# Altium schematic sheet BUJT13-VN02-20140328.SchDoc
size C
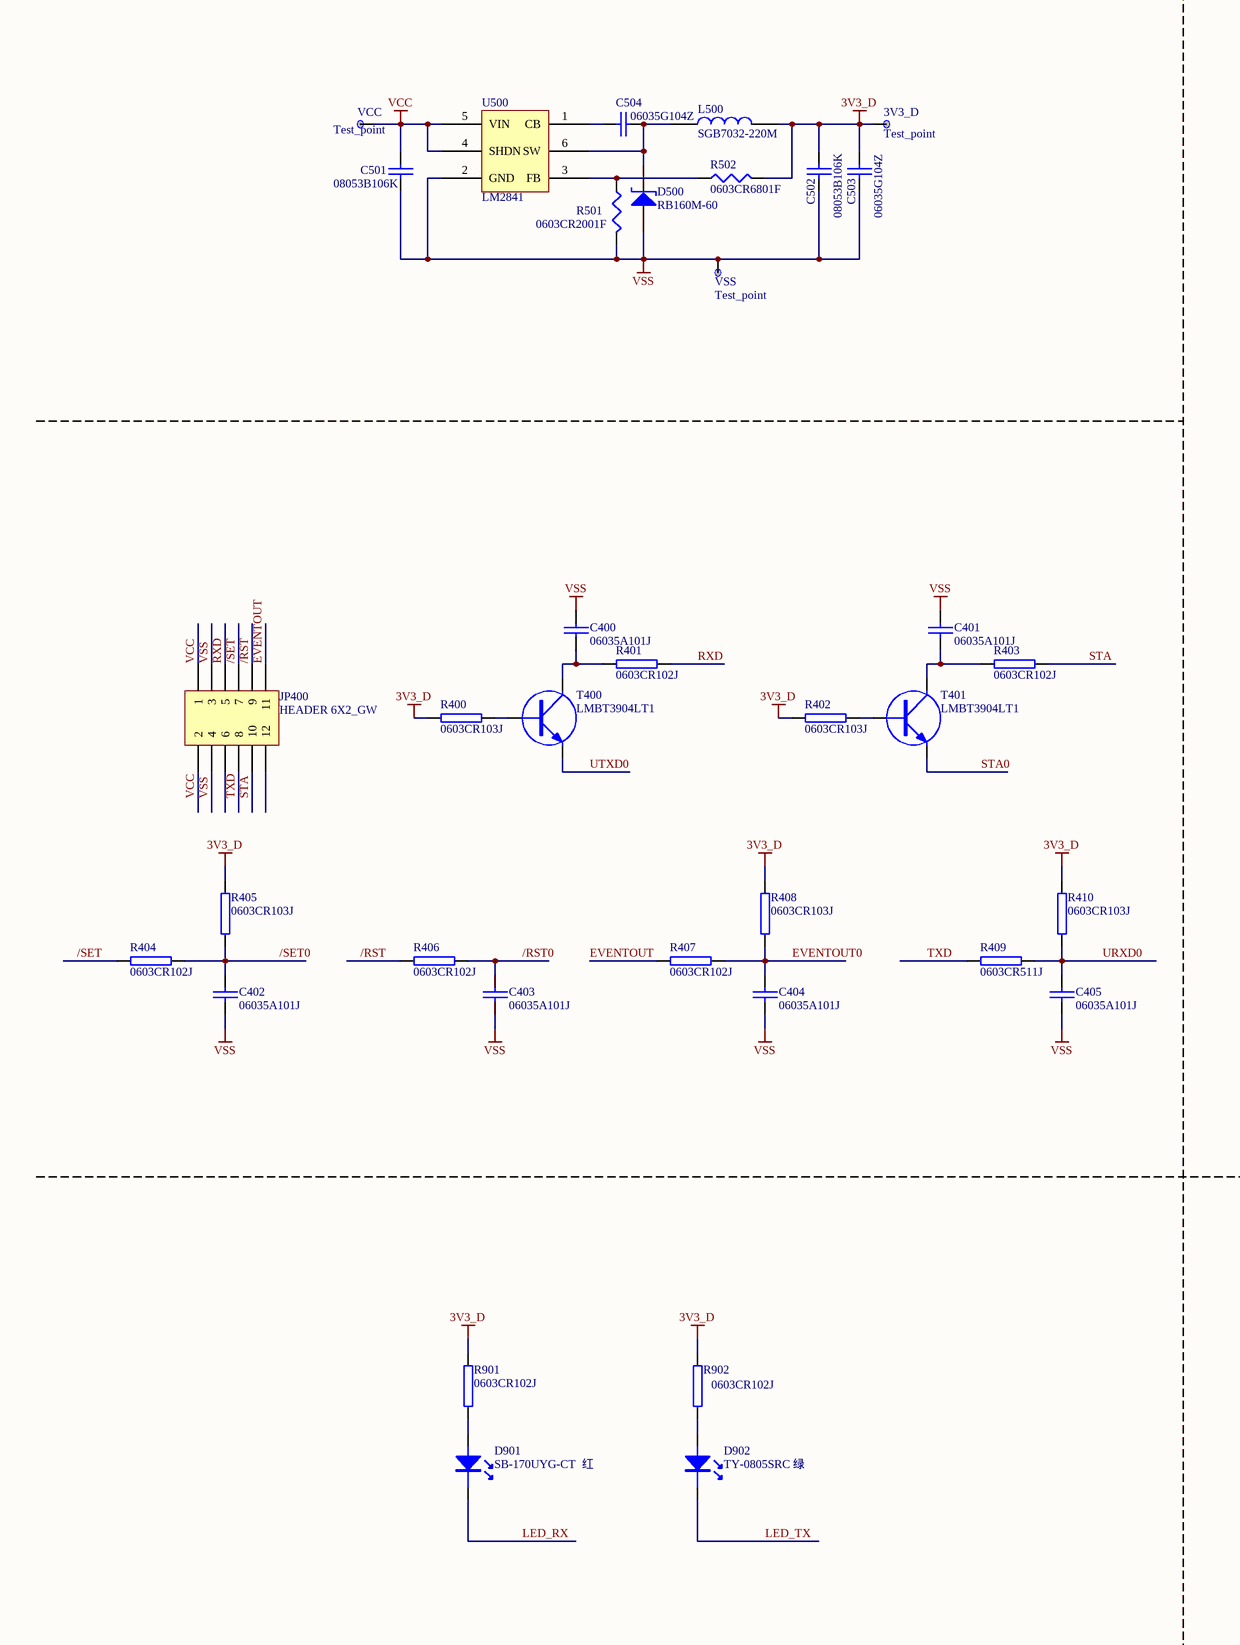
[diagram p0: BUJT13-VN02-20140328.SchDoc, left]
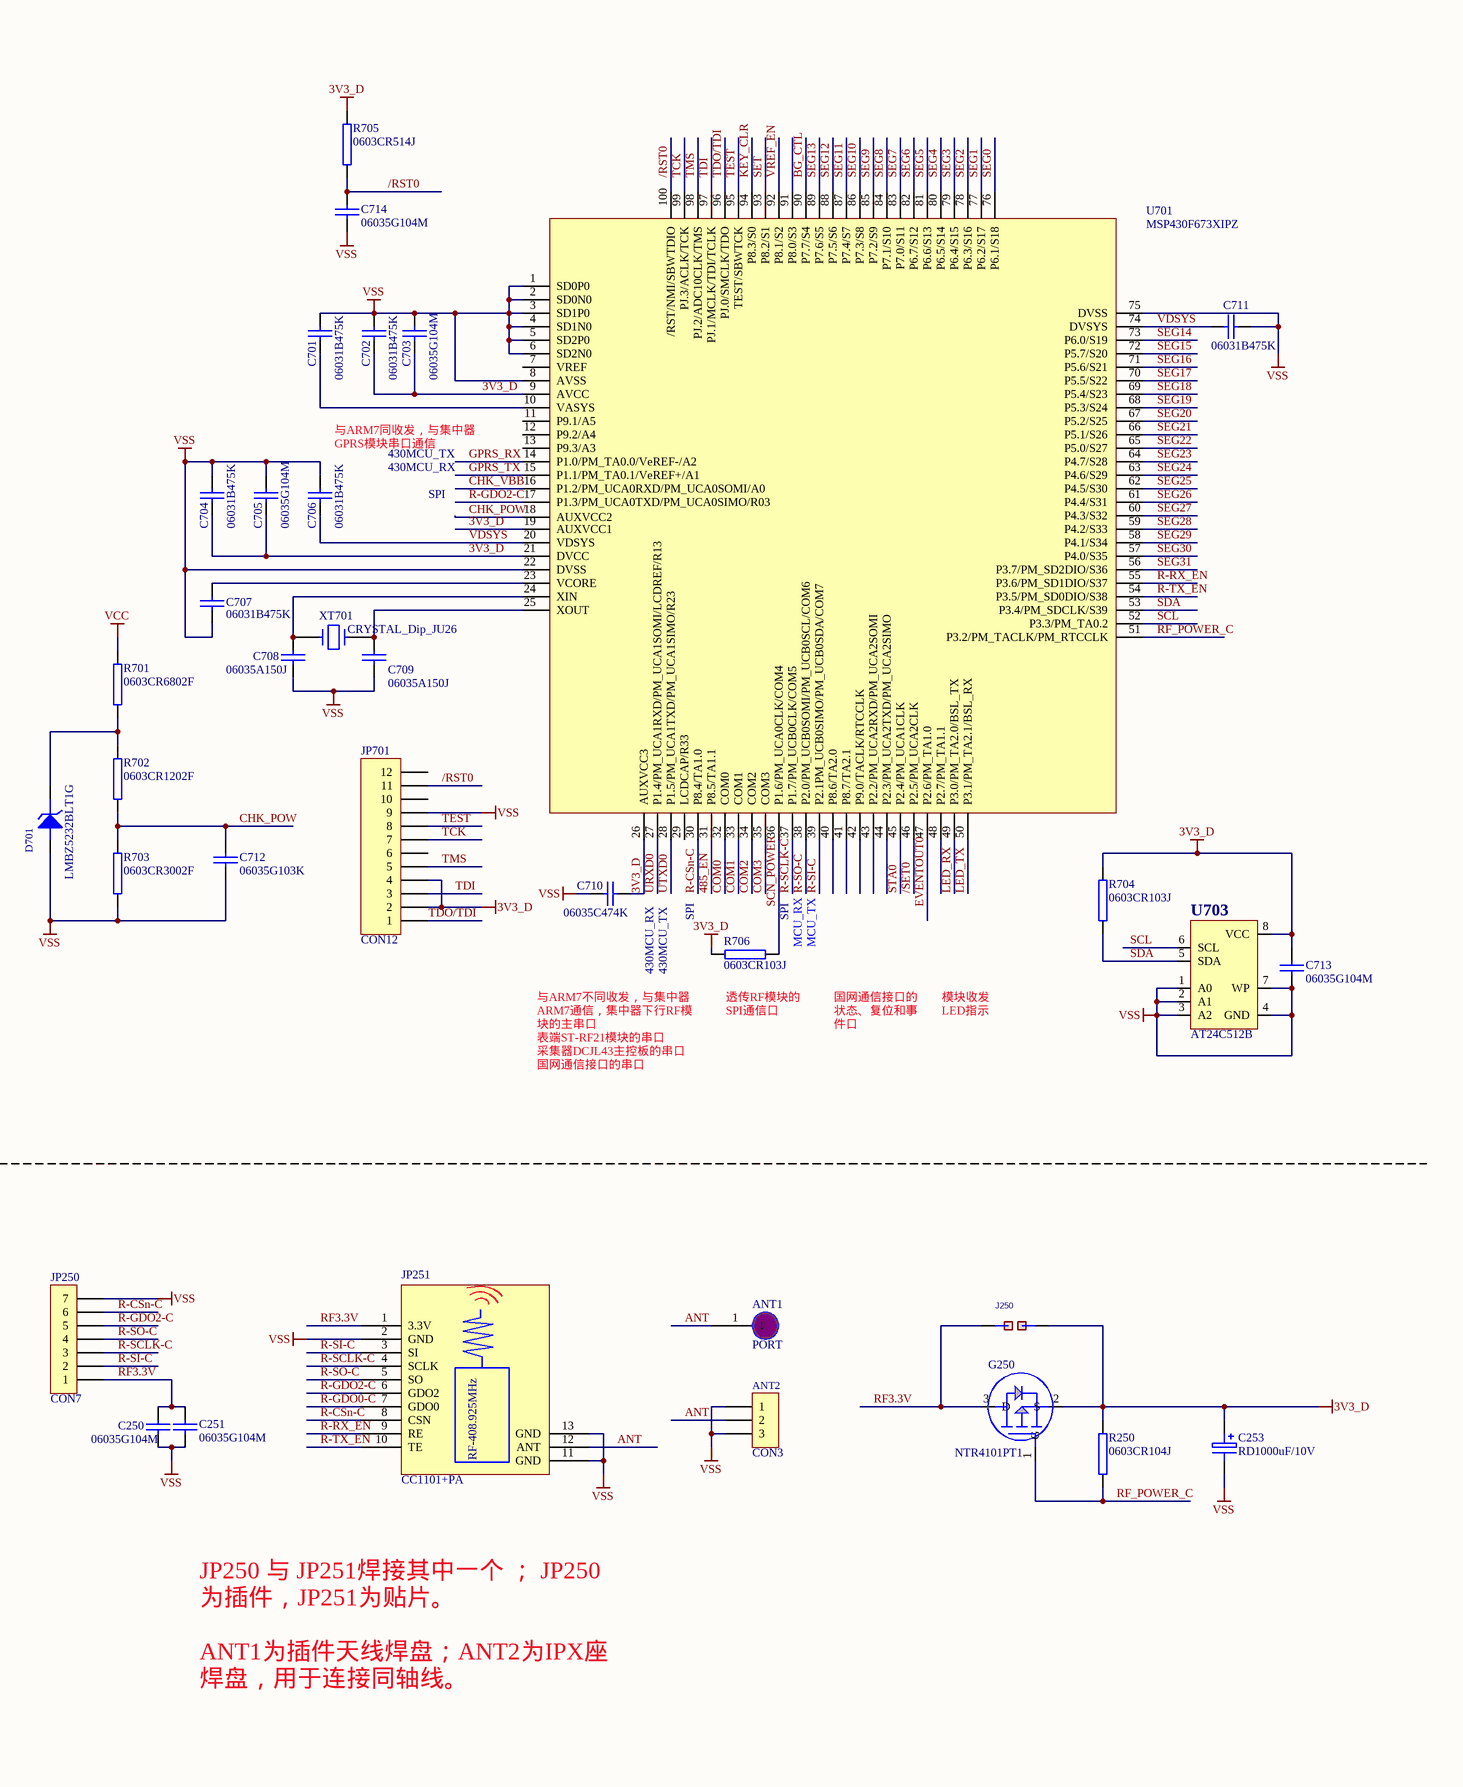
[diagram p1: BUJT13-VN02-20140328.SchDoc, right]

## Parts
3V3_D  Test_point  [test_port]
ANT1  PORT  [ANT1]
ANT2  CON3  [RF_IPX]
C250  06035G104M  [0603C]
C251  06035G104M  [0603C]
C253  RD1000uF/10V  [CAP_ALU10.0_5.0_DOWN]
C400  06035A101J  [0603C]
C401  06035A101J  [0603C]
C402  06035A101J  [0603C]
C403  06035A101J  [0603C]
C404  06035A101J  [0603C]
C405  06035A101J  [0603C]
C501  08053B106K  [0805C]
C502  08053B106K  [0805C]
C503  06035G104Z  [0603C]
C504  06035G104Z  [0603C]
C701  06031B475K  [0603C]
C702  06031B475K  [0603C]
C703  06035G104M  [0603C]
C704  06031B475K  [0603C]
C705  06035G104M  [0603C]
C706  06031B475K  [0603C]
C707  06031B475K  [0603C]
C708  06035A150J  [0603C]
C709  06035A150J  [0603C]
C710  06035C474K  [0603C]
C711  06031B475K  [0603C]
C712  06035G103K  [0603C]
C713  06035G104M  [0603C]
C714  06035G104M  [0603C]
D500  RB160M-60  [RB160M]
D701  LMBZ5232BLT1G  [LMBZ5230BLT1G]
D901  SB-170UYG-CT  红  [0805-LED]
D902  TY-0805SRC 绿  [0805-LED]
G250  NTR4101PT1  [SOT-23]
J250  JUMP-0603 NC  [JUMP2]  (value not drawn)
JP250  CON7  [RF_CC1101-1-NOANT]
JP251  CC1101+PA  [CC1101-S-PA]
JP400  HEADER 6X2_GW  [IDC12G_GW]
JP701  CON12  [IDC12G]
L500  SGB7032-220M  [SGB7032]
R250  0603CR104J  [0603R]
R400  0603CR103J  [0603R]
R401  0603CR102J  [0603R]
R402  0603CR103J  [0603R]
R403  0603CR102J  [0603R]
R404  0603CR102J  [0603R]
R405  0603CR103J  [0603R]
R406  0603CR102J  [0603R]
R407  0603CR102J  [0603R]
R408  0603CR103J  [0603R]
R409  0603CR511J  [0603R]
R410  0603CR103J  [0603R]
R501  0603CR2001F  [0603R]
R502  0603CR6801F  [0603R]
R701  0603CR6802F  [0603R]
R702  0603CR1202F  [0603R]
R703  0603CR3002F  [0603R]
R704  0603CR103J  [0603R]
R705  0603CR514J  [0603R]
R706  0603CR103J  [0603R]
R901  0603CR102J  [0603R]
R902  0603CR102J  [0603R]
T400  LMBT3904LT1  [SOT-23]
T401  LMBT3904LT1  [SOT-23]
U500  LM2841  [SOT-23-6L]
U701  MSP430F673XIPZ  [LQFP100 - 1]
U703  AT24C512B  [SOP-8]
VCC  Test_point  [test_port]
VSS  Test_point  [test_port]
XT701  CRYSTAL_Dip_JU26  [XTAL-DIP-JU26]

## Nets
3V3_D: 3V3_D.1 C253.1 C502.1 C503.2 C702.2 C703.2 C704.2 C705.2 C710.2 C713.1 G250.2(S) J250.1(R1) JP701.2 JP701.4 L500.2 R250.1 R400.1 R402.1 R405.2 R408.1 R410.2 R502.2 R704.2 R705.2 R706.1 R901.2 R902.2 U701.9(AVCC) U701.19(AUXVCC1) U701.21(DVCC) U701.26(AUXVCC3) U703.8(VCC)
VCC: C501.1 JP400.1 JP400.2 R701.2 U500.4(SHDN) U500.5(VIN) VCC.1
VSS: ANT2.1 ANT2.3 C250.2 C251.2 C253.2 C400.1 C401.1 C402.2 C403.2 C404.2 C405.2 C501.2 C502.2 C503.1 C701.1 C702.1 C703.1 C704.1 C705.1 C706.1 C707.2 C708.2 C709.2 C710.1 C711.2 C712.2 C713.2 C714.2 D500.A D701.A JP250.7 JP251.2(GND) JP251.11(GND) JP251.13(GND) JP400.3 JP400.4 JP701.9 R501.2 R703.1 U500.2(GND) U701.1(SD0P0) U701.2(SD0N0) U701.3(SD1P0) U701.4(SD1N0) U701.5(SD2P0) U701.6(SD2N0) U701.8(AVSS) U701.22(DVSS) U701.75(DVSS) U703.1(A0) U703.2(A1) U703.3(A2) U703.4(GND) U703.7(WP) VSS.1
485_EN: U701.31(P8.5/TA1.1)
/RST: JP400.9 R406.2
/RST0: C403.1 C714.1 JP701.11 R406.1 R705.1 U701.100(/RST/NMI/SBWTDIO)
/SET: JP400.7 R404.1
/SET0: C402.1 R404.2 R405.1 U701.46(P2.5/PM_UCA2CLK)
ANT: ANT1.1 ANT2.2 JP251.12(ANT)
BG_CTL: U701.90(P7.7/S4)
CHK_POW: C712.1 R702.1 R703.2 U701.18(AUXVCC2)
CHK_VBB: U701.16(P1.2/PM_UCA0RXD/PM_UCA0SOMI/A0)
COM0: U701.32(COM0)
COM1: U701.33(COM1)
COM2: U701.34(COM2)
COM3: U701.35(COM3)
EVENTOUT: JP400.11 R407.2
EVENTOUT0: C404.1 R407.1 R408.2 U701.47(P2.6/PM_TA1.0)
GPRS_RX: U701.14(P1.0/PM_TA0.0/VeREF-/A2)
GPRS_TX: U701.15(P1.1/PM_TA0.1/VeREF+/A1)
KEY_CLR: U701.94(P8.3/S0)
LED_RX: D901.K U701.49(P3.0/PM_TA2.0/BSL_TX)
LED_TX: D902.K U701.50(P3.1/PM_TA2.1/BSL_RX)
R-CSn-C: JP250.6 JP251.8(CSN) U701.30(P8.4/TA1.0)
R-GDO0-C: JP251.7(GDO0)
R-GDO2-C: JP250.5 JP251.6(GDO2) U701.17(P1.3/PM_UCA0TXD/PM_UCA0SIMO/R03)
R-RX_EN: JP251.9(RE) U701.55(P3.6/PM_SD1DIO/S37)
R-SCLK-C: JP250.3 JP251.4(SCLK) U701.37(P1.7/PM_UCB0CLK/COM5)
R-SI-C: JP250.2 JP251.3(SI) U701.39(P2.1PM_UCB0SIMO/PM_UCB0SDA/COM7)
R-SO-C: JP250.4 JP251.5(SO) U701.38(P2.0/PM_UCB0SOMI/PM_UCB0SCL/COM6)
R-TX_EN: JP251.10(TE) U701.54(P3.5/PM_SD0DIO/S38)
RF3.3V: C250.1 C251.1 G250.3(D) J250.2(R2) JP250.1 JP251.1(3.3V)
RF_POWER_C: G250.1(G) R250.2 U701.51(P3.2/PM_TACLK/PM_RTCCLK)
RXD: JP400.5 R401.2
SCL: U701.52(P3.3/PM_TA0.2) U703.6(SCL)
SCN_POWER: R706.2 U701.36(P1.6/PM_UCA0CLK/COM4)
SDA: R704.1 U701.53(P3.4/PM_SDCLK/S39) U703.5(SDA)
SEG0: U701.76(P6.1/S18)
SEG1: U701.77(P6.2/S17)
SEG2: U701.78(P6.3/S16)
SEG3: U701.79(P6.4/S15)
SEG4: U701.80(P6.5/S14)
SEG5: U701.81(P6.6/S13)
SEG6: U701.82(P6.7/S12)
SEG7: U701.83(P7.0/S11)
SEG8: U701.84(P7.1/S10)
SEG9: U701.85(P7.2/S9)
SEG10: U701.86(P7.3/S8)
SEG11: U701.87(P7.4/S7)
SEG12: U701.88(P7.5/S6)
SEG13: U701.89(P7.6/S5)
SEG14: U701.73(P6.0/S19)
SEG15: U701.72(P5.7/S20)
SEG16: U701.71(P5.6/S21)
SEG17: U701.70(P5.5/S22)
SEG18: U701.69(P5.4/S23)
SEG19: U701.68(P5.3/S24)
SEG20: U701.67(P5.2/S25)
SEG21: U701.66(P5.1/S26)
SEG22: U701.65(P5.0/S27)
SEG23: U701.64(P4.7/S28)
SEG24: U701.63(P4.6/S29)
SEG25: U701.62(P4.5/S30)
SEG26: U701.61(P4.4/S31)
SEG27: U701.60(P4.3/S32)
SEG28: U701.59(P4.2/S33)
SEG29: U701.58(P4.1/S34)
SEG30: U701.57(P4.0/S35)
SEG31: U701.56(P3.7/PM_SD2DIO/S36)
SET: U701.93(P8.2/S1)
STA: JP400.10 R403.2
STA0: T401.2(E) U701.45(P2.4/PM_UCA1CLK)
TCK: JP701.7 U701.99(PJ.3/ACLK/TCK)
TDI: JP701.3 U701.97(PJ.1/MCLK/TDI/TCLK)
TDO/TDI: JP701.1 U701.96(PJ.0/SMCLK/TDO)
TEST: JP701.8 U701.95(TEST/SBWTCK)
TMS: JP701.5 U701.98(PJ.2/ADC10CLK/TMS)
TXD: JP400.8 R409.1
URXD0: C405.1 R409.2 R410.1 U701.27(P1.4/PM_UCA1RXD/PM_UCA1SOMI/LCDREF/R13)
UTXD0: T400.2(E) U701.28(P1.5/PM_UCA1TXD/PM_UCA1SIMO/R23)
VDSYS: C706.2 C711.1 U701.20(VDSYS) U701.74(DVSYS)
VREF_EN: U701.92(P8.1/S2)
NetC400_2: C400.2 R401.1 T400.3(C)
NetC401_2: C401.2 R403.1 T401.3(C)
NetC504_1: C504.1 U500.1(CB)
NetC504_2: C504.2 D500.K L500.1 U500.6(SW)
NetC701_2: C701.2 U701.10(VASYS)
NetC707_1: C707.1 U701.23(VCORE)
NetC708_1: C708.1 U701.24(XIN) XT701.1
NetC709_1: C709.1 U701.25(XOUT) XT701.2
NetD701_K: D701.K R701.1 R702.2
NetD901_A: D901.A R901.1
NetD902_A: D902.A R902.1
NetR400_2: R400.2 T400.1(B)
NetR402_2: R402.2 T401.1(B)
NetR501_1: R501.1 R502.1 U500.3(FB)

Not connected (* = marked no-connect by the designer): JP400 6 12; JP701 6 10 12; U701 7(VREF) 11(P9.1/A5) 12(P9.2/A4) 13(P9.3/A3) 29(LCDCAP/R33) 40(P8.6/TA2.0) 41(P8.7/TA2.1) 42(P9.0/TACLK/RTCCLK) 43(P2.2/PM_UCA2RXD/PM_UCA2SOMI) 44(P2.3/PM_UCA2TXD/PM_UCA2SIMO) 48(P2.7/PM_TA1.1) 91(P8.0/S3)

## Notes on the sheet
- 与ARM7同收发，与集中器GPRS模块串口通信
- 430MCU_TX
- 430MCU_RX
- SPI
- (near R706) SPI
- (near R706) MCU_RX
- (near R706) MCU_TX
- (near C710) 430MCU_RX
- (near R706) 透传RF模块的SPI通信口
- (near R706) 与ARM7不同收发，与集中器ARM7通信，集中器下行RF模块的主串口
  表端ST-RF21模块的串口
  采集器DCJL43主控板的串口
  国网通信接口的串口
- 国网通信接口的状态、复位和事件口
- 模块收发LED指示
- JP250 与 JP251焊接其中一个 ； JP250为插件，JP251为贴片。
- ANT1为插件天线焊盘；ANT2为IPX座焊盘，用于连接同轴线。
- (in symbol CC1101+PA) RF-408.925MHz

## Library data of the parts
ANT2 = CON3: Connector
C250 C251 C400-C405 C501-C504 C701-C714 = CAP
C253 = CA45 10uF/M 16V: Electrolytic Capacitor
D701 = ZENER3_7: Zener Diode
D901 D902 = LED_5
G250 = MOSFET_P
J250 = GDC_NO-0603: VAL: 0R; DEV: GDC_0603NO_01; REF: NA; BOI: 0603; TOL: NA; DESIG: NA; FAB: NA; PUI: NA
JP250 = CON7: Connector
JP701 = CON12: Connector
R250 R701-R706 R901 R902 = RES2
R400-R410 = RES2_0603
R501 R502 = RES1
T400 T401 = NPN
U703 = 24C01
XT701 = CRYSTAL_Dip_JU26: Crystal